# Altium schematic sheet top_schematic.SchDoc: Top Schematic
size A4; Date: 27.05.2014; Author: Stefan Lüthi; Organization: BFH; Address1: Bern University of Applied Sciences; Address2: Engineering and Information Technology; Address3: Jlcoweg 1; Address4: CH-3400 Burgdorf; DocumentNumber: 1; Revision: 1.0; SheetNumber: 1; SheetTotal: 8; CurrentDate: 27.05.2014
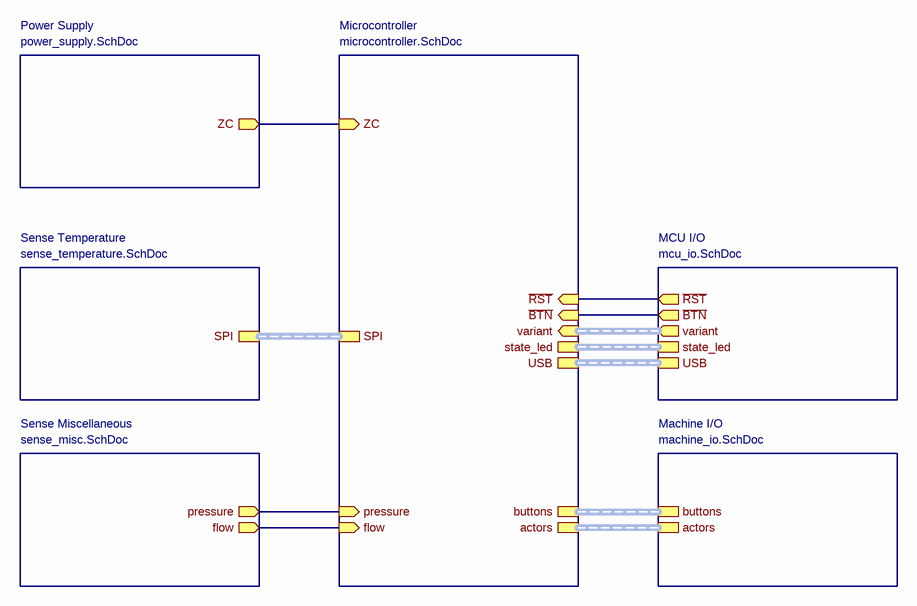
[diagram p0: top_schematic.SchDoc]

## Sub-sheets
Machine I/O = machine_io.SchDoc: buttons (harness buttons), actors (harness actors)
MCU I/O = mcu_io.SchDoc: USB (harness USB), ~{RST} (out), ~{BTN} (out), state_led (harness state_led), variant (out, harness variant)
Microcontroller = microcontroller.SchDoc: actors (harness actors), USB (harness USB), flow (in), ~{RST} (in), pressure (in), ZC (in), SPI (harness SPI), state_led (harness state_led), ~{BTN} (in), buttons (harness buttons), variant (in, harness variant)
Power Supply = power_supply.SchDoc: ZC (out)
Sense Miscellaneous = sense_misc.SchDoc: pressure (out), flow (out)
Sense Temperature = sense_temperature.SchDoc: SPI (harness SPI)

## Nets
(unnamed): sheet Power Supply/ZC, sheet Microcontroller/ZC
(unnamed): sheet Microcontroller/flow, sheet Sense Miscellaneous/flow
(unnamed): sheet Microcontroller/~{RST}, sheet MCU I/O/~{RST}
(unnamed): sheet Microcontroller/pressure, sheet Sense Miscellaneous/pressure
(unnamed): sheet Microcontroller/~{BTN}, sheet MCU I/O/~{BTN}

## Buses and harness runs
harness sheet Machine I/O/actors = sheet Microcontroller/actors
harness sheet Machine I/O/buttons = sheet Microcontroller/buttons
harness sheet MCU I/O/state_led = sheet Microcontroller/state_led
harness sheet MCU I/O/USB = sheet Microcontroller/USB
harness sheet MCU I/O/variant = sheet Microcontroller/variant
harness sheet Microcontroller/SPI = sheet Sense Temperature/SPI

## Notes on the sheet
- Author:
- Title:
- Number:
- Product:
- Sheet
- of
- Variant:
- Revision:
- File:
- Template:
- A4SL CC-BY-SA (07-17)